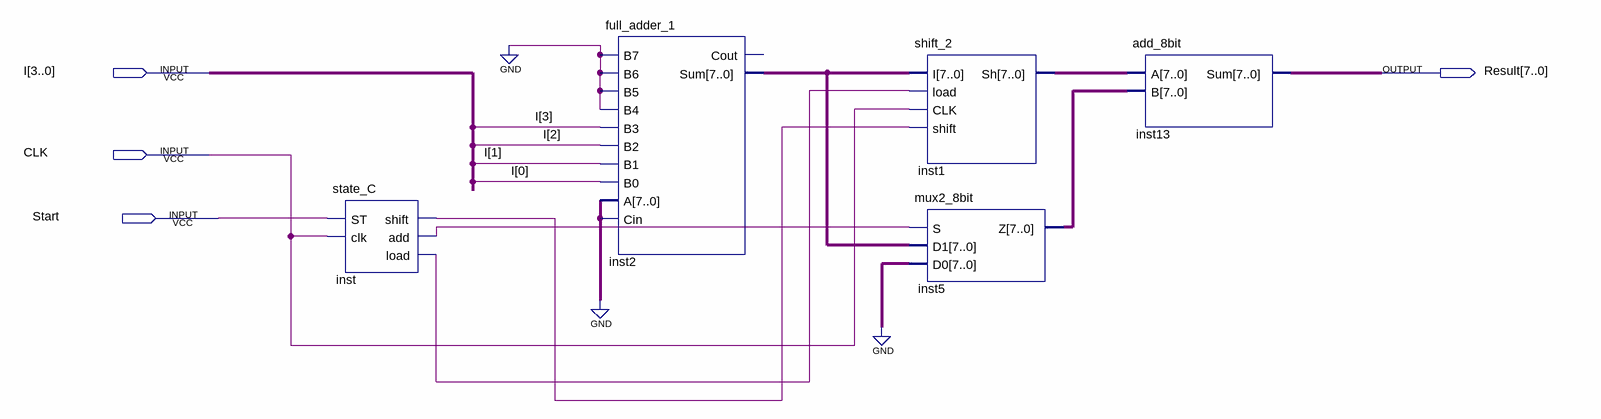
[diagram p0: schematic sheet]
// Quartus schematic Multiply.bdf as structural Verilog: 5 symbols, 4 pins
module Multiply (
  input  [3:0] I,
  input  CLK,
  input  Start,
  output [7:0] Result
);

  wire inst_add, inst_load, inst_shift;
  wire [7:0] inst1_sh, inst2_sum, inst5_z;

  state_C inst (.ST(Start), .clk(CLK), .shift(inst_shift), .add(inst_add), .load(inst_load));
  full_adder_1 inst2 (
    .B7(1'b0), .B6(1'b0), .B5(1'b0), .B4(1'b0), .B3(I[3]), .B2(I[2]), .B1(I[1]), .B0(I[0]), .A({8{1'b0}}),
    .Cin({8{1'b0}}), .Sum(inst2_sum));  // open: Cout
  shift_2 inst1 (.I(inst2_sum), .load(inst_load), .CLK(CLK), .shift(inst_shift), .Sh(inst1_sh));
  mux2_8bit inst5 (.S(inst_add), .D1(inst2_sum), .D0({8{1'b0}}), .Z(inst5_z));
  add_8bit inst13 (.A(inst1_sh), .B(inst5_z), .Sum(Result));
endmodule
